# Altium schematic sheet ADC_Breakout.SchDoc
size A; SheetNumber: 1; SheetTotal: 1
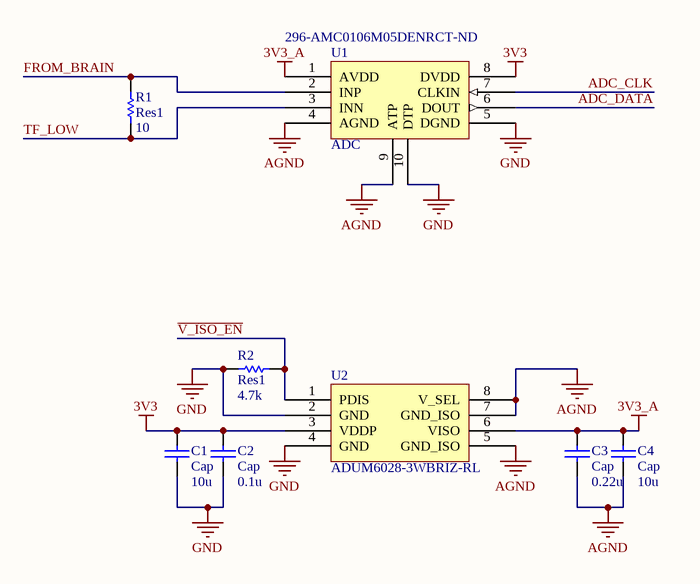
[diagram p0: ADC_Breakout.SchDoc]

## Parts
C1  Cap  value 10u  [CAPC1608X05N]
C2  Cap  value 0.1u  [CAPC1608X05N]
C3  Cap  value 0.22u  [CAPC1608X05N]
C4  Cap  value 10u  [CAPC1608X05N]
R1  Res1  value 10  [0402_Res]
R2  Res1  value 4.7k  [0402_Res]
U1  ADC  Supplier Part Number 1: 296-AMC0106M05DENRCT-ND  [SON65P350X100_HS-9N]
U2  ADUM6028-3WBRIZ-RL  [ADUM6028-3WBRIZ-RL]

## Nets
3V3: C1.2 C2.2 U1.8(DVDD) U2.3(VDDP)
3V3_A: C3.2 C4.2 U1.1(AVDD) U2.6(VISO)
AGND: C3.1 C4.1 U1.4(AGND) U1.9(ATP) U2.5(GND_ISO) U2.7(GND_ISO) U2.8(V_SEL)
GND: C1.1 C2.1 R2.1 U1.5(DGND) U1.10(DTP) U2.2(GND) U2.4(GND)
~{V_ISO_EN}: R2.2 U2.1(PDIS)
ADC_CLK: U1.7(CLKIN)
ADC_DATA: U1.6(DOUT)
FROM_BRAIN: R1.1 U1.2(INP)
TF_LOW: R1.2 U1.3(INN)

## Library data of the parts
C1-C4 = Cap: Capacitor; Published: 8-Jun-2000; LatestRevisionDate: 17-Jul-2002; LatestRevisionNote: Re-released for DXP Platform.; PackageReference: RAD-0.3; Publisher: Altium Limited; PackageDescription: Radial Cap, Thru-Hole; 2 Leads; 0.3 in Pin Spacing
R1 R2 = Res1: Resistor; Published: 8-Jun-2000; LatestRevisionDate: 17-Jul-2002; LatestRevisionNote: Re-released for DXP Platform.; PackageReference: AXIAL-0.3; Publisher: Altium Limited; PackageDescription: Axial Device, Thru-Hole; 2 Leads; 0.3 in Pin Spacing
U1 = ADC: Supplier 1: DigiKey